# EAGLE design AetherMesh Test Fixture Mezz V1.0 (EAGLE 8.3.1)
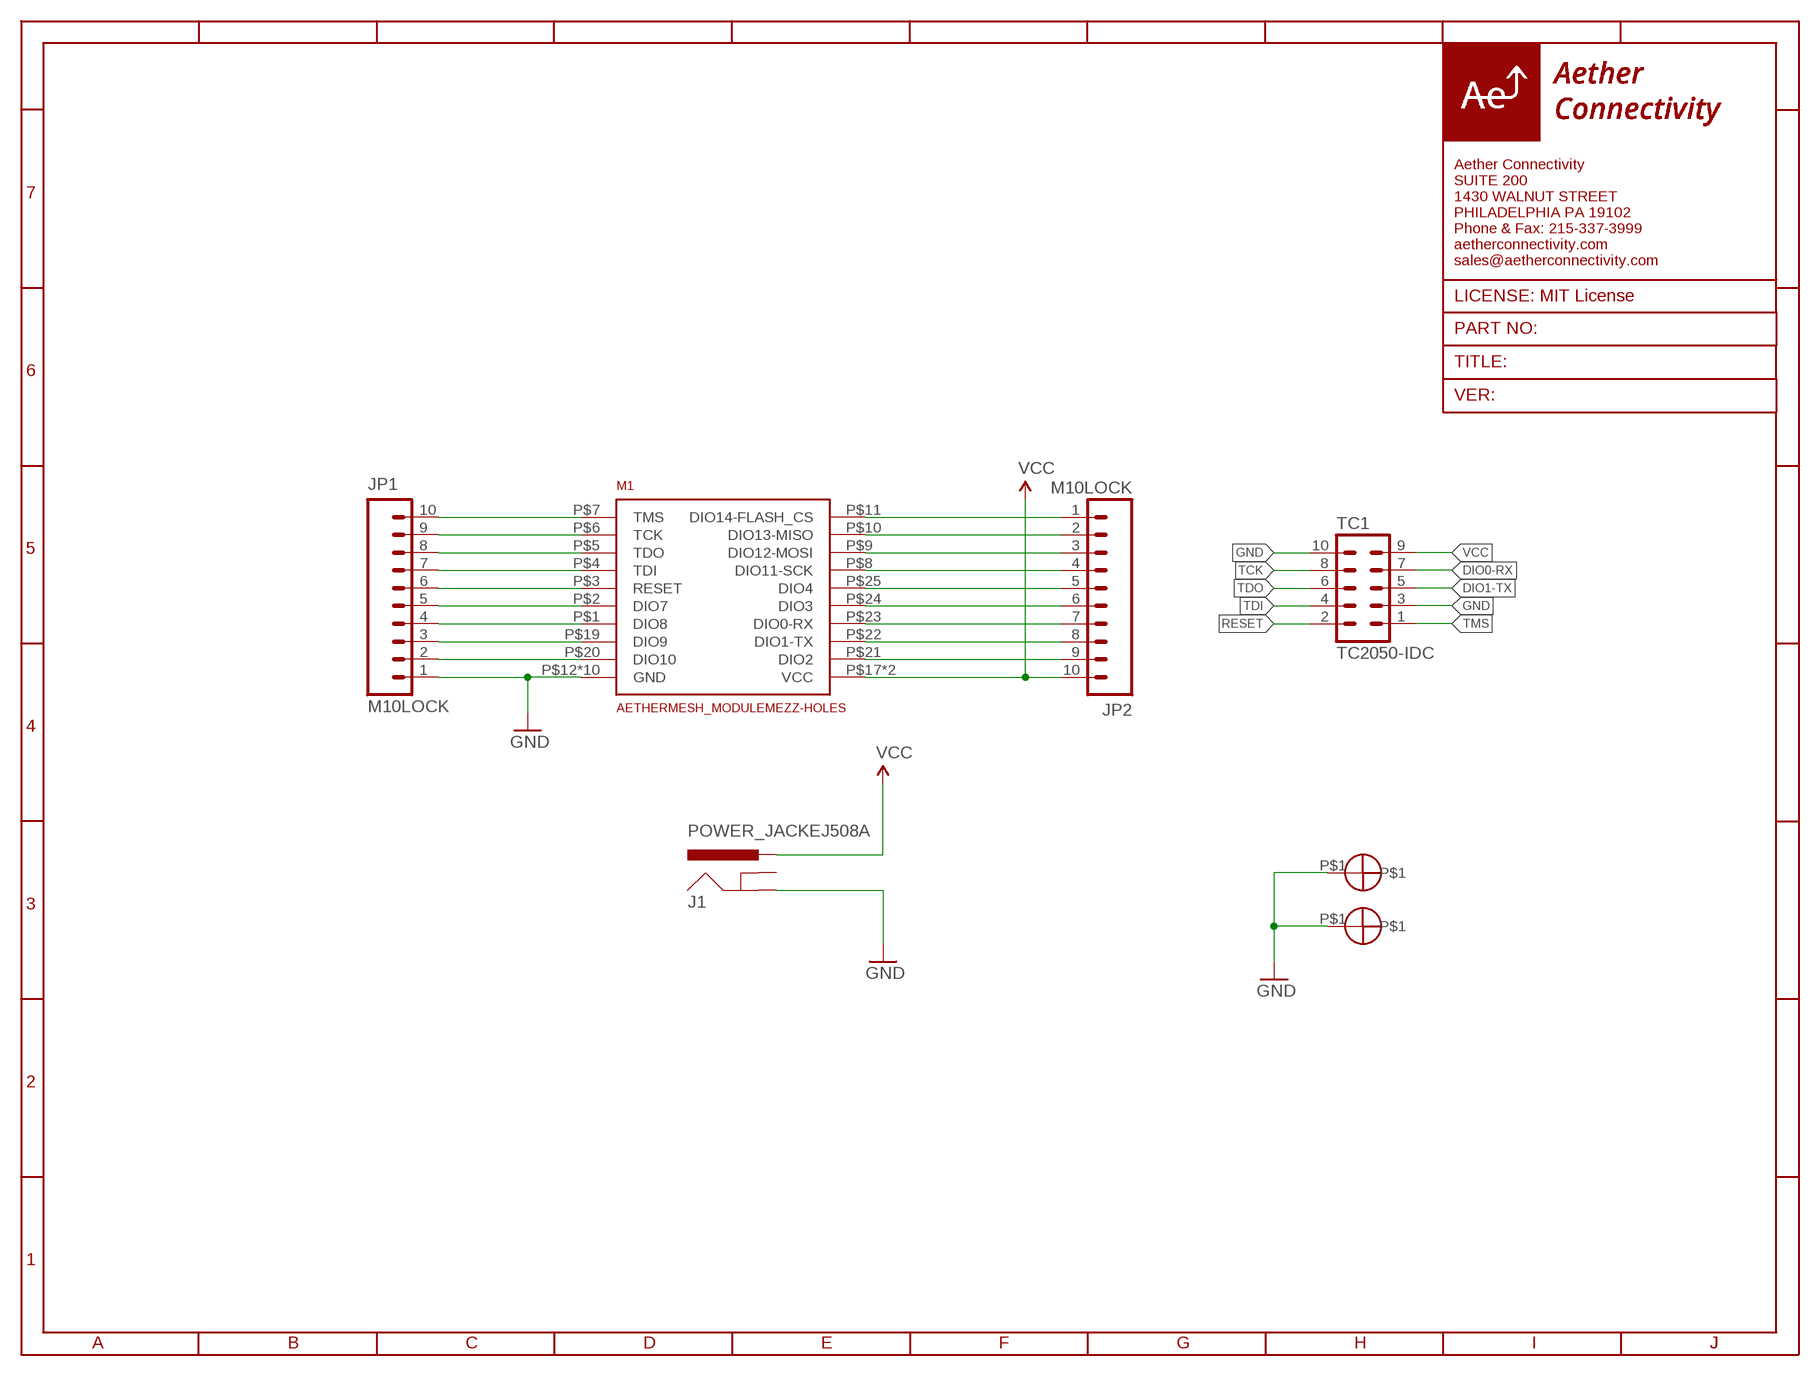
[diagram p0: schematic, sheet 1]

## Parts
J1  POWER_JACKEJ508A  [DC_JACK_EJ508A]
JP1  M10LOCK  [1X10_LOCK]
JP2  M10LOCK  [1X10_LOCK]
M1  AETHERMESH_MODULEMEZZ-HOLES  [AETHERMESH_MEZZ_MOUNT_HOLES]
S1  STANDOFFWURTH  [STANDOFF_WURTH_9774040243R]
S2  STANDOFFWURTH  [STANDOFF_WURTH_9774040243R]
TC1  TC2050-IDC  [TC2050-IDC]

## Nets
BUTTON: JP1.2 M1.P$20(DIO10)
CS: JP1.5 M1.P$2(DIO7)
DIO0-RX: JP2.7 M1.P$23(DIO0-RX) TC1.7
DIO1-TX: JP2.8 M1.P$22(DIO1-TX) TC1.5
DIO2: JP2.9 M1.P$21(DIO2)
DIO3: JP2.6 M1.P$24(DIO3)
DIO4: JP2.5 M1.P$25(DIO4)
ENC_RESET: JP1.4 M1.P$1(DIO8)
GND: J1.1(GND) JP1.1 M1.P$12(GND) M1.P$13(GND) M1.P$14(GND) M1.P$15(GND) M1.P$16(GND) M1.P$26(GND) M1.P$27(GND) M1.P$28(GND) M1.P$29(GND) M1.P$30(GND) S1.P$1 S2.P$1 TC1.3 TC1.10
INT: JP1.3 M1.P$19(DIO9)
MISO: JP2.2 M1.P$10(DIO13-MISO)
MOSI: JP2.3 M1.P$9(DIO12-MOSI)
N$1: JP2.1 M1.P$11(DIO14-FLASH_CS)
RESET: JP1.6 M1.P$3(RESET) TC1.2
SCK: JP2.4 M1.P$8(DIO11-SCK)
TCK: JP1.9 M1.P$6(TCK) TC1.8
TDI: JP1.7 M1.P$4(TDI) TC1.4
TDO: JP1.8 M1.P$5(TDO) TC1.6
TMS: JP1.10 M1.P$7(TMS) TC1.1
VCC: J1.3(PWR) JP2.10 M1.P$17(VCC) M1.P$18(VCC) TC1.9
Unconnected: J1.2(GNDBREAK)

## Library data of the parts
J1 = 3. growflux:POWER_JACK: Power Jack This is the standard 5.5mm barrel jack for power. The PTH is the most common, proven, reliable, footprint. The Slot footprint only works if the mill layer is transmitted to the PCB fab house so be warned. Mating wall wart : TOL-00298 (and others)
JP1 JP2 = 3. growflux:M10: Header 10 Standard 10-pin 0.1" header. Use with straight break away headers (SKU : PRT-00116), right angle break away headers (PRT-00553), swiss pins (PRT-00743), machine pins (PRT-00117), and female headers (PRT-00115).
M1 = AetherConnectivity:AETHERMESH_MODULE
S1 S2 = AetherConnectivity:STANDOFF; MFG#: 4882
TC1 = TagConnect:TC2050-IDC: Tag-Connect In Circuit Programming & Debug Cable 10 Pin http://www.tag-connect.com

## Board
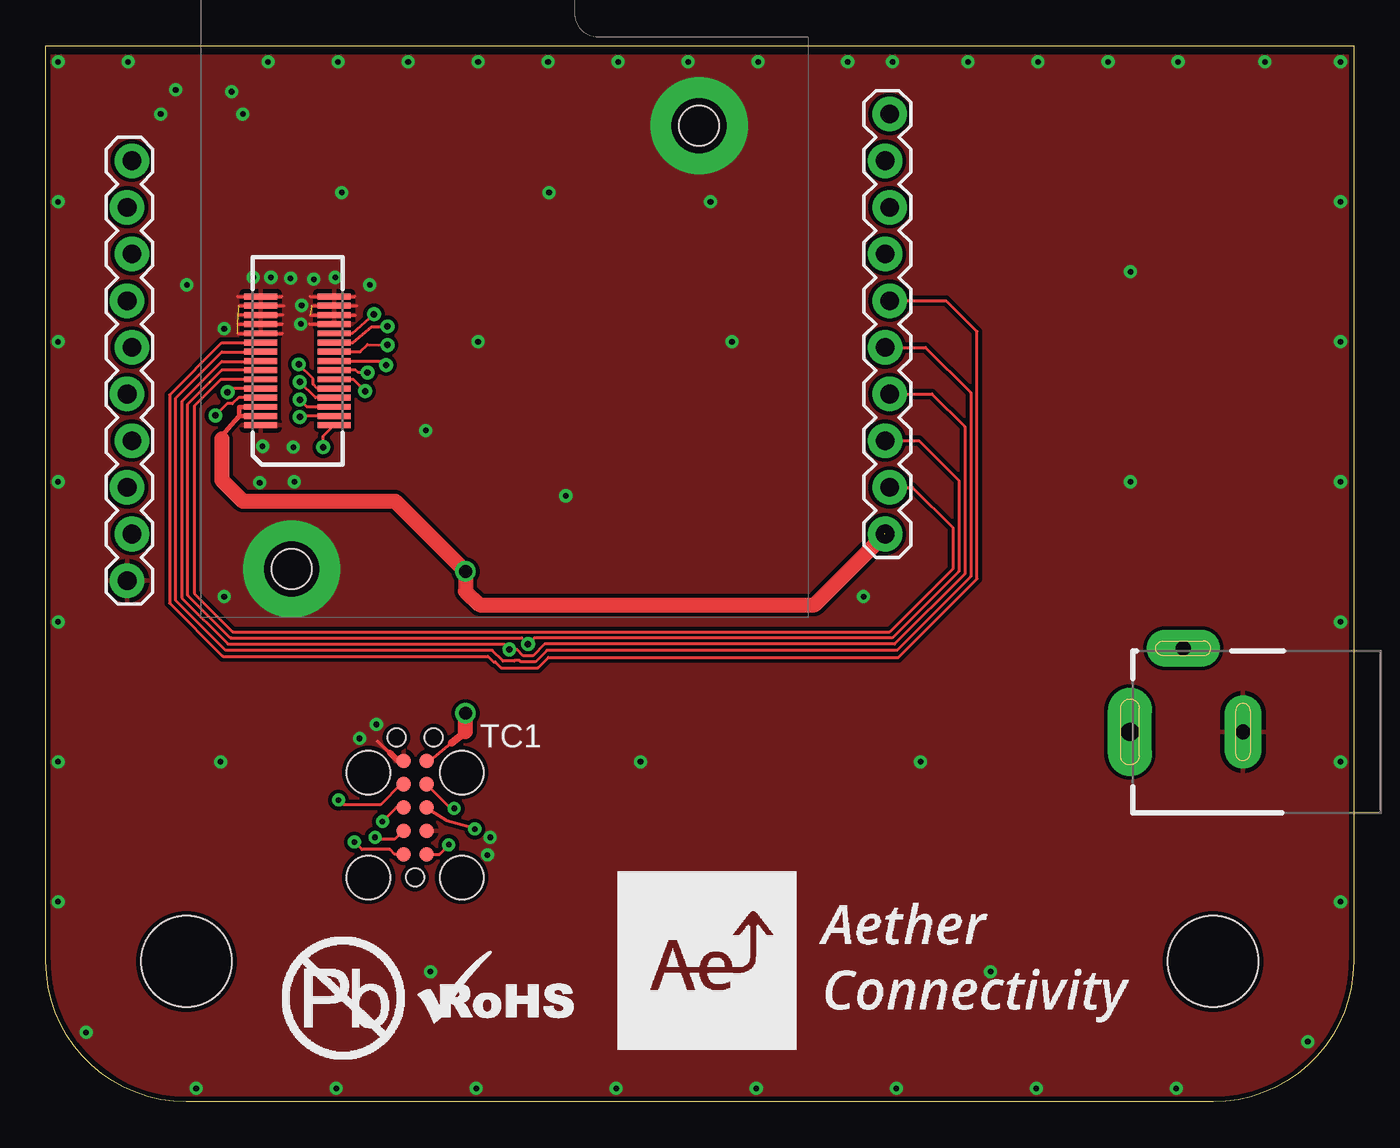
[diagram p1: board, top side]
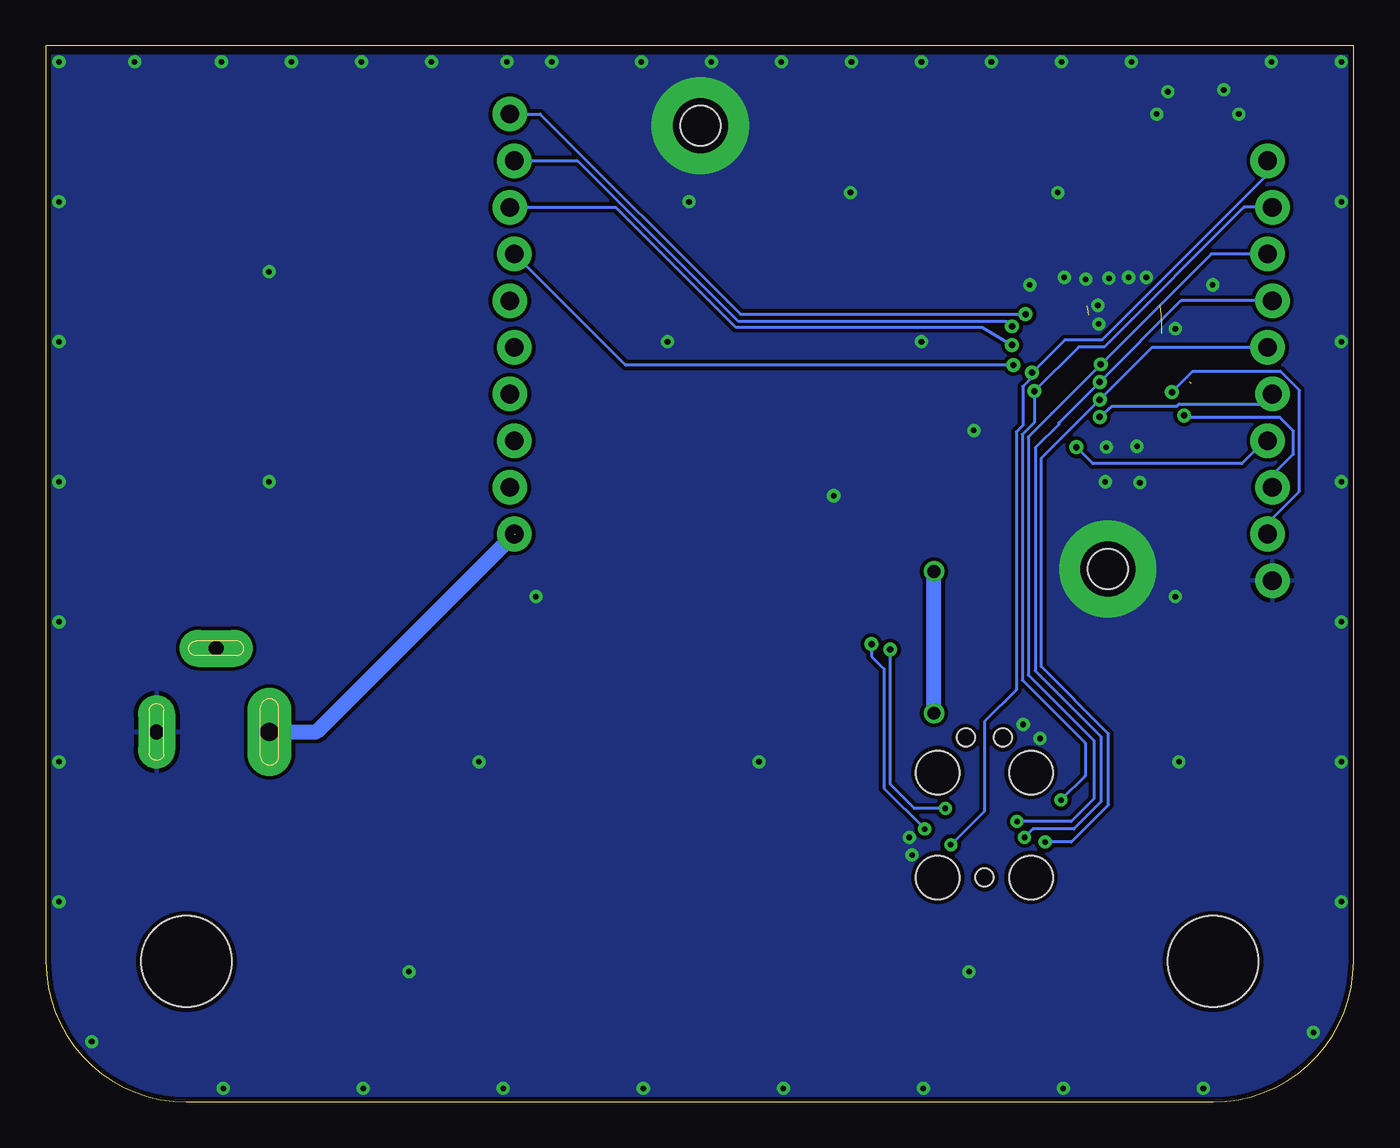
[diagram p2: board, bottom side, seen from below]

Size 71.17 x 57.48 mm. Coordinates in mm from the lower left corner, seen from the top.
Outline: 71.17,7.65 arc-90 63.53,0 7.65,0 arc-90 0,7.65 0,57.48 71.17,57.48 71.17,7.65
Copper layers (1*16): Top 0.035mm / dielectric 1.5mm / Bottom 0.035mm
Design rules "default *": minimum track width 6mil, minimum drill 12mil, track to track 7mil, track to pad 7mil, pad to pad 7mil, via to via 7mil, smd to smd 7mil, copper to edge 10mil, drill to drill 8mil, minimum pad ring 10mil, minimum via ring 8mil, stop-mask expansion 4mil, vias tented up to drill 20mil, thermal gap 10mil
Holes 4.95 mm at 7.65,7.65 63.53,7.65
vRestrict: area 59.4,3.5 to 67.7,11.8; area 3.5,3.5 to 11.8,11.8

### Footprints (pad centres in the part's own frame; a part is rotated, then mirrored left to right if it is on the bottom)
DC_JACK_EJ508A = drill 0.8 pad 2 long: 1 0,0; 2 4.55,3.25 | drill 1 pad 2.4 long: 3 0,6.15
1X10_LOCK = drill 1.016 pad 1.88: 1 0,0.127; 2 2.54,-0.127; 3 5.08,0.127; 4 7.62,-0.127; 5 10.16,0.127; 6 12.7,-0.127; 7 15.24,0.127; 8 17.78,-0.127; 9 20.32,0.127; 10 22.86,-0.127
AETHERMESH_MEZZ_MOUNT_HOLES = smd 1.8 x 0.32: P$1 2,-3.5; P$2 2,-3; P$3 2,-2.5; P$4 2,-2; P$5 2,-1.5; P$6 2,-1; P$7 2,-0.5; P$8 2,0; P$9 2,0.5; P$10 2,1; P$11 2,1.5; P$12 2,2; P$13 2,2.5; P$14 2,3; P$15 2,3.5; P$16 -2,-3.5; P$17 -2,-3; P$18 -2,-2.5; P$19 -2,-2; P$20 -2,-1.5; P$21 -2,-1; P$22 -2,-0.5; P$23 -2,0; P$24 -2,0.5; P$25 -2,1; P$26 -2,1.5; P$27 -2,2; P$28 -2,2.5; P$29 -2,3; P$30 -2,3.5 | hole 2.2: 21.857,12.802; -0.318,-11.328
STANDOFF_WURTH_9774040243R = drill 3 pad 5.3: P$1 0,0
TC2050-IDC = smd 0.787 x 0.787: 1 -2.54,-0.635; 2 -2.54,0.635; 3 -1.27,-0.635; 4 -1.27,0.635; 5 0,-0.635; 6 0,0.635; 7 1.27,-0.635; 8 1.27,0.635; 9 2.54,-0.635; 10 2.54,0.635 | hole 0.991: -3.81,0; 3.81,1.016; 3.81,-1.016 | hole 2.375: -3.81,2.54; -3.81,-2.54; 1.905,2.54; 1.905,-2.54

### Placement (x,y rotation side)
J1  65.15,20.14 90 top
JP1  4.55,28.37 90 top
JP2  45.8,53.77 270 top
M1  13.69,40.34 0 top
S1  35.55,53.14 0 top
S2  13.37,29.01 0 top
TC1  20.09,16.03 90 top

### Tracks (layer width: path | path; a pad name or v marks a point on that pad's centre or on a via)
BUTTON  (via drill 0.35)
  Top 0.152: M1.P$20 10.08,38.84 v9.88,38.63
  Bottom 0.152: JP1.2 4.67,31.51 2.95,33.24 2.95,38.75 3.94,39.74 3.94,39.75 8.76,39.75 v9.88,38.63
CS  (via drill 0.35)
  Top 0.152: M1.P$2 13.87,37.34 v13.82,37.29
  Bottom 0.152: v13.82,37.29 13.13,37.87 9.61,37.87 9.48,38 4.96,38 JP1.5
DIO0-RX  (via drill 0.3, 0.35)
  Top 0.152: TC1.7 20.73,17.27 22.02,15.98 v22.22,15.98 | JP2.7 48.23,38.53 50.01,36.75 50.01,28.75 46.18,24.92 27.13,24.92 26.5,24.29 25.98,24.29 25.63,24.63 v25.22,24.63 24.93,24.92 9.92,24.92 7.39,27.44 7.39,38.13 9.58,40.31 11.67,40.31 M1.P$23
  Bottom 0.152: v22.22,15.98 23.9,15.98 25.22,17.3 v25.22,24.63
DIO1-TX  (via drill 0.3, 0.35)  (1 unrouted)
  Top 0.152: TC1.5 20.73,16 21.82,15.32 23.29,14.91 v23.34,14.86 | JP2.8 47.52,35.99 49.68,33.83 49.68,28.88 46.06,25.26 26.58,25.26 v26.24,24.92 25.89,25.26 10.08,25.26 | 8.95,39.21 7.72,37.99 7.72,27.58 10.04,25.26 | M1.P$22 9.57,39.84 8.87,39.14 | 10.04,25.26 10.08,25.26 | 10.08,25.26 10.04,25.26
  Bottom 0.152: v23.34,14.86 25.55,17.07 25.55,23.57 26.24,24.26 v26.24,24.92
DIO2
  Top 0.152: JP2.9 47.17,33.45 49.35,31.27 49.35,29.02 45.92,25.59 10.17,25.59 8.08,27.69 8.08,37.88 9.53,39.34 M1.P$21 | M1.P$21
DIO3
  Top 0.152: JP2.6 47.88,41.07 50.34,38.61 50.34,28.61 46.32,24.59 27.27,24.59 26.64,23.96 25.84,23.96 25.76,24.03 25.52,24.03 25.48,24 24.87,24 24.28,24.59 9.78,24.59 7.06,27.31 7.06,38.3 9.58,40.82 11.67,40.82 M1.P$24
DIO4
  Top 0.152: M1.P$25 11.68,41.33 9.58,41.33 6.73,38.48 6.73,27.15 9.6,24.28 | JP2.5 49,43.61 50.67,41.94 50.67,28.47 46.41,24.21 27.36,24.21 26.77,23.63 24.78,23.63 24.45,23.95 24.36,23.95 24.05,24.26 9.64,24.26 9.62,24.28 9.6,24.28 | 9.6,24.28 9.63,24.26
ENC_RESET  (via drill 0.35)
  Top 0.152: v15.09,35.64 15.09,36.23 M1.P$1
  Bottom 0.152: JP1.4 4.83,35.99 6.07,34.75 14.2,34.75 v15.09,35.64
GND  (via drill 0.3)  (4 unrouted)
  Top 0.152: 10.41,43.84 12.85,43.84 | 10.52,43.33 12.95,43.33 | 10.46,42.85 12.9,42.85 | 10.44,42.34 12.88,42.34 | 10.44,41.83 12.88,41.83 | 14.38,43.84 16.81,43.84 | 14.48,43.33 16.92,43.33 | 14.4,42.82 16.84,42.82 | 14.33,42.34 16.48,42.34
  Top 0.203: TC1.10 19.18,18.57 | 18.69,19.02 18.67,19.02 18.06,19.63
  Top 0.305: 19.18,18.57 18.69,19.02
  other vias: 43.64,56.62 46.08,56.62 6.25,53.77 7.06,55.09 10.72,53.77 10.11,54.99 0.66,56.62 0.66,49 0.66,41.38 0.66,33.76 0.66,10.9 8.18,0.74 15.9,56.62 23.52,56.62 31.14,56.62 38.76,56.62 54,56.62 61.62,56.62 70.46,56.62 19.71,56.62 27.33,56.62 34.95,56.62 50.19,56.62 57.81,56.62 66.34,56.62 4.47,56.62 12.09,56.62 15.8,0.74 23.42,0.74 38.66,0.74 61.52,0.74 70.46,41.38 70.46,33.76 70.46,26.14 70.46,10.9 16.1,49.5 27.38,49.5 23.52,41.38 28.3,32.99 37.34,41.38 20.68,36.55 17.07,19.79 17.98,20.55 24.03,13.44 24.18,14.4 0.66,26.14 0.66,18.52 31.04,0.74 46.28,0.74 53.9,0.74 70.46,18.52 70.46,49 59.03,45.19 59.03,33.76 47.6,18.52 32.36,18.52 9.5,18.52 51.41,7.09 20.93,7.09 36.17,49 2.18,3.78 68.68,3.28 9.7,27.51 44.5,27.51 11.28,44.88 12.24,44.88 13.31,44.83 14.58,44.78 15.75,44.88 17.63,44.48 13.92,43.36 13.87,42.34 9.7,42.09 7.67,44.48 11.79,35.69 13.46,35.64 11.63,33.71 13.51,33.76
  pour Bottom (isolate 0.203, rank 2): 0.28,56.92 0.28,7.9 arc90 7.9,0.28 63.53,0.28 arc90 70.89,7.65 70.89,56.92
  pour Top (isolate 0.203, rank 2): 0.28,56.92 0.28,7.9 arc90 7.9,0.28 63.53,0.28 arc90 70.89,7.65 70.89,56.92
INT  (via drill 0.35)
  Top 0.152: v9.22,37.36 9.86,38 10.14,38 10.48,38.34 M1.P$19
  Bottom 0.152: JP1.3 4.42,34.11 3.28,35.26 3.28,36.53 4.01,37.26 9.02,37.26 v9.22,37.36
MISO  (via drill 0.35)
  Top 0.152: M1.P$10 16.72,41.34 17.75,42.19 18.57,42.19 v18.59,42.22
  Bottom 0.152: JP2.2 42.24,51.23 33.5,42.49 18.87,42.49 v18.59,42.22
MOSI  (via drill 0.35)
  Top 0.152: M1.P$9 17.11,40.84 17.5,41.22 v18.59,41.2
  Bottom 0.152: JP2.3 40.17,48.69 33.64,42.16 20.22,42.16 v18.59,41.2
N$1  (via drill 0.35)
  Top 0.152: M1.P$11 16.69,41.86 v17.86,42.88
  Bottom 0.152: JP2.1 44.27,53.77 33.38,42.88 v17.86,42.88
RESET  (via drill 0.3, 0.35)
  Top 0.152: TC1.2 18.97,13.49 18.72,13.74 17.2,13.74 v16.79,14.15 | M1.P$3 14.2,37.84 v13.82,38.22
  Bottom 0.152: v16.79,14.15 15.37,14.15 13.33,16.18 13.33,20.04 16.99,23.7 16.99,35.05 v13.82,38.22 10.97,41.07 JP1.6
SCK  (via drill 0.35)
  Top 0.152: M1.P$8 18.29,40.34 v18.52,40.11
  Bottom 0.152: v18.52,40.11 39.62,40.11 JP2.4
TCK  (via drill 0.3, 0.35)
  Top 0.152: 19.33,17.3 18.21,16.18 16.18,16.18 v15.93,16.43 | M1.P$6 16.72,39.34 v17.37,38.68
  Top 0.203: TC1.8 19.33,17.3
  Bottom 0.152: v15.93,16.43 14.6,17.75 14.6,19.53 18.03,22.96 18.03,36.33 17.37,36.99 v17.37,38.68 14.96,41.1 13.56,41.1 5.97,48.69 JP1.9
TDI  (via drill 0.3, 0.35)
  Top 0.152: 19.43,14.76 18.97,14.3 18.01,14.3 v17.91,14.4 | M1.P$4 14.67,38.34 v13.82,39.19
  Top 0.203: TC1.4 19.43,14.76
  Bottom 0.152: v17.91,14.4 17.45,14.86 15.21,14.86 13.74,16.33 13.74,19.89 17.32,23.47 17.32,35.61 16.05,36.88 16.05,36.96 v13.82,39.19 9.4,43.61 JP1.7
TDO  (via drill 0.3, 0.35)
  Top 0.152: 19.08,16.03 v18.31,15.27 | v13.76,40.15 14.54,39.37 14.54,39.07 14.77,38.84 M1.P$5
  Top 0.203: TC1.6 19.08,16.03
  Bottom 0.152: v18.31,15.27 15.37,15.27 14.15,16.48 14.15,19.69 17.7,23.24 17.7,36.2 16.43,37.47 v13.76,40.15 7.75,46.15 JP1.8
TMS  (via drill 0.3, 0.35)
  Top 0.152: TC1.1 21.41,13.49 v21.92,14 | v17.5,39.7 16.99,39.7 16.87,39.83 15.7,39.83 M1.P$7
  Bottom 0.152: v21.92,14 20.09,15.82 20.09,20.7 18.36,22.43 18.36,36.47 18.01,36.83 18.01,38.95 17.49,39.46 v17.49,39.71 | JP1.10 4.67,50.5 13.69,41.48 15.72,41.48 v17.49,39.71 | v17.49,39.71 v17.5,39.7
VCC  (via drill 0.7)  (1 unrouted)
  Top 0.152: TC1.9 20.9,18.57 20.93,18.59 22.07,19.53
  Top 0.254: M1.P$17 10.51,37.34 10.28,37.07 | 10.28,37.07 9.58,36.25 9.58,36.09 | M1.P$18 10.52,37.84 10.52,37.3 10.28,37.07
  Top 0.406: 22.07,19.53 22.83,20.14
  Top 0.813: 45.69,30.86 45.64,30.91 | JP2.10 45.67,30.89 41.83,27.05 23.61,27.05 22.83,27.8 v22.83,28.88 19.01,32.7 10.72,32.7 9.58,33.85 9.58,36.09 | 22.83,20.14 v22.83,21.16
  Bottom 0.813: J1.3 56.44,20.14 JP2.10 | v22.83,21.16 v22.83,28.88